# EasyEDA schematic Schematic_КР2024_schema_2024-06-13.json
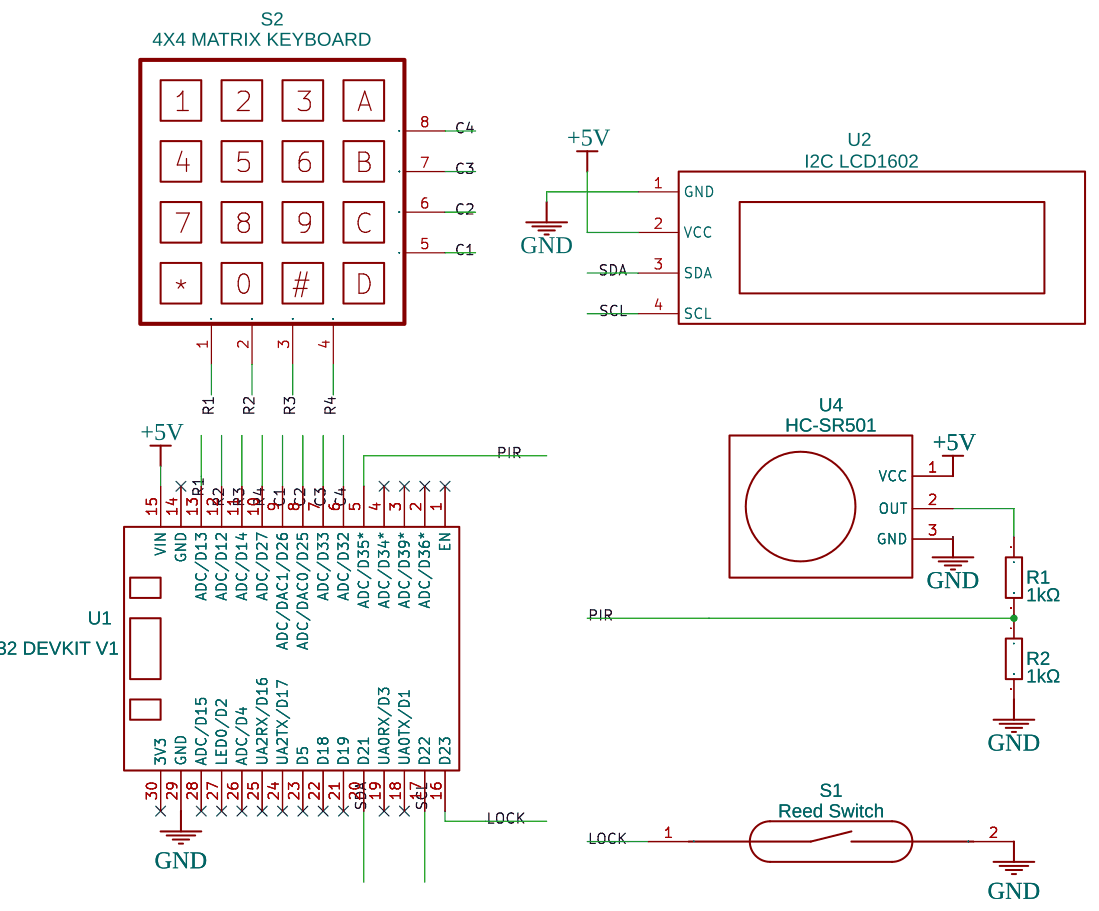
[diagram p0: schematic sheet]

## Parts
R1  1kΩ  [RES-TH_BD4.2-L12.0-P16.00-D0.8]
R2  1kΩ  [RES-TH_BD4.2-L12.0-P16.00-D0.8]
S1  Reed Switch  [REED SWITCH GINO]
S2  4X4 MATRIX KEYBOARD  [4X4-MATRIX-KEYBOARD]
U1  ESP32 DEVKIT V1  [DOIT-ESP32-DEVKIT-V1]
U2  I2C LCD1602  [1602 LCD I2C]
U4  HC-SR501

## Library data of the parts
R1 R2 = MBE04140C1001FC 100: Contributor: lcsc; Supplier: LCSC; Supplier Part: C3374101; Manufacturer: VISHAY(威世); Manufacturer Part: MBE04140C1001FC100; JLCPCB Part Class: Extended Part
S1 = Reed Switch: Contributor: pogorielov.bogdan
S2 = 4X4 MATRIX KEYBOARD: Contributor: pogorielov.bogdan
U1 = ESP32 DEVKIT V1: Contributor: pogorielov.bogdan
U2 = I2C LCD1602: Contributor: pogorielov.bogdan
U4 = HC-SR501: Contributor: pogorielov.bogdan

## Nets
+5V: U1.15(VIN) U2.2(VCC) U4.1(VCC)
GND: R2.2 S1.2 U1.29(GND) U2.1(GND) U4.3(GND)
C1: S2.5(R1) U1.9(ADC/DAC1/D26)
C2: S2.6(R2) U1.8(ADC/DAC0/D25)
C3: S2.7(R3) U1.7(ADC/D33)
C4: S2.8(R4) U1.6(ADC/D32)
LOCK: S1.1 U1.16(D23)
PIR: R1.2 R2.1 U1.5(ADC/D35*)
R1: S2.1(C1) U1.13(ADC/D13)
R2: S2.2(C2) U1.12(ADC/D12)
R3: S2.3(C3) U1.11(ADC/D14)
R4: S2.4(C4) U1.10(ADC/D27)
SCL: U1.17(D22) U2.4(SCL)
SDA: U1.20(D21) U2.3(SDA)
Net-(R1-1): R1.1 U4.2(OUT)

Not connected (* = marked no-connect by the designer): U1 1(EN)* 2(ADC/D36*)* 3(ADC/D39*)* 4(ADC/D34*)* 14(GND)* 18(UA0TX/D1)* 19(UA0RX/D3)* 21(D19)* 22(D18)* 23(D5)* 24(UA2TX/D17)* 25(UA2RX/D16)* 26(ADC/D4)* 27(LED0/D2)* 28(ADC/D15)* 30(3V3)*
